# EasyEDA schematic LucidVRSensorPCB Side.json
TITLE: LucidVRSensorProto5; REV: 1.0; Date: 2022-12-27; Sheet: 1/1; Company: moonwiz
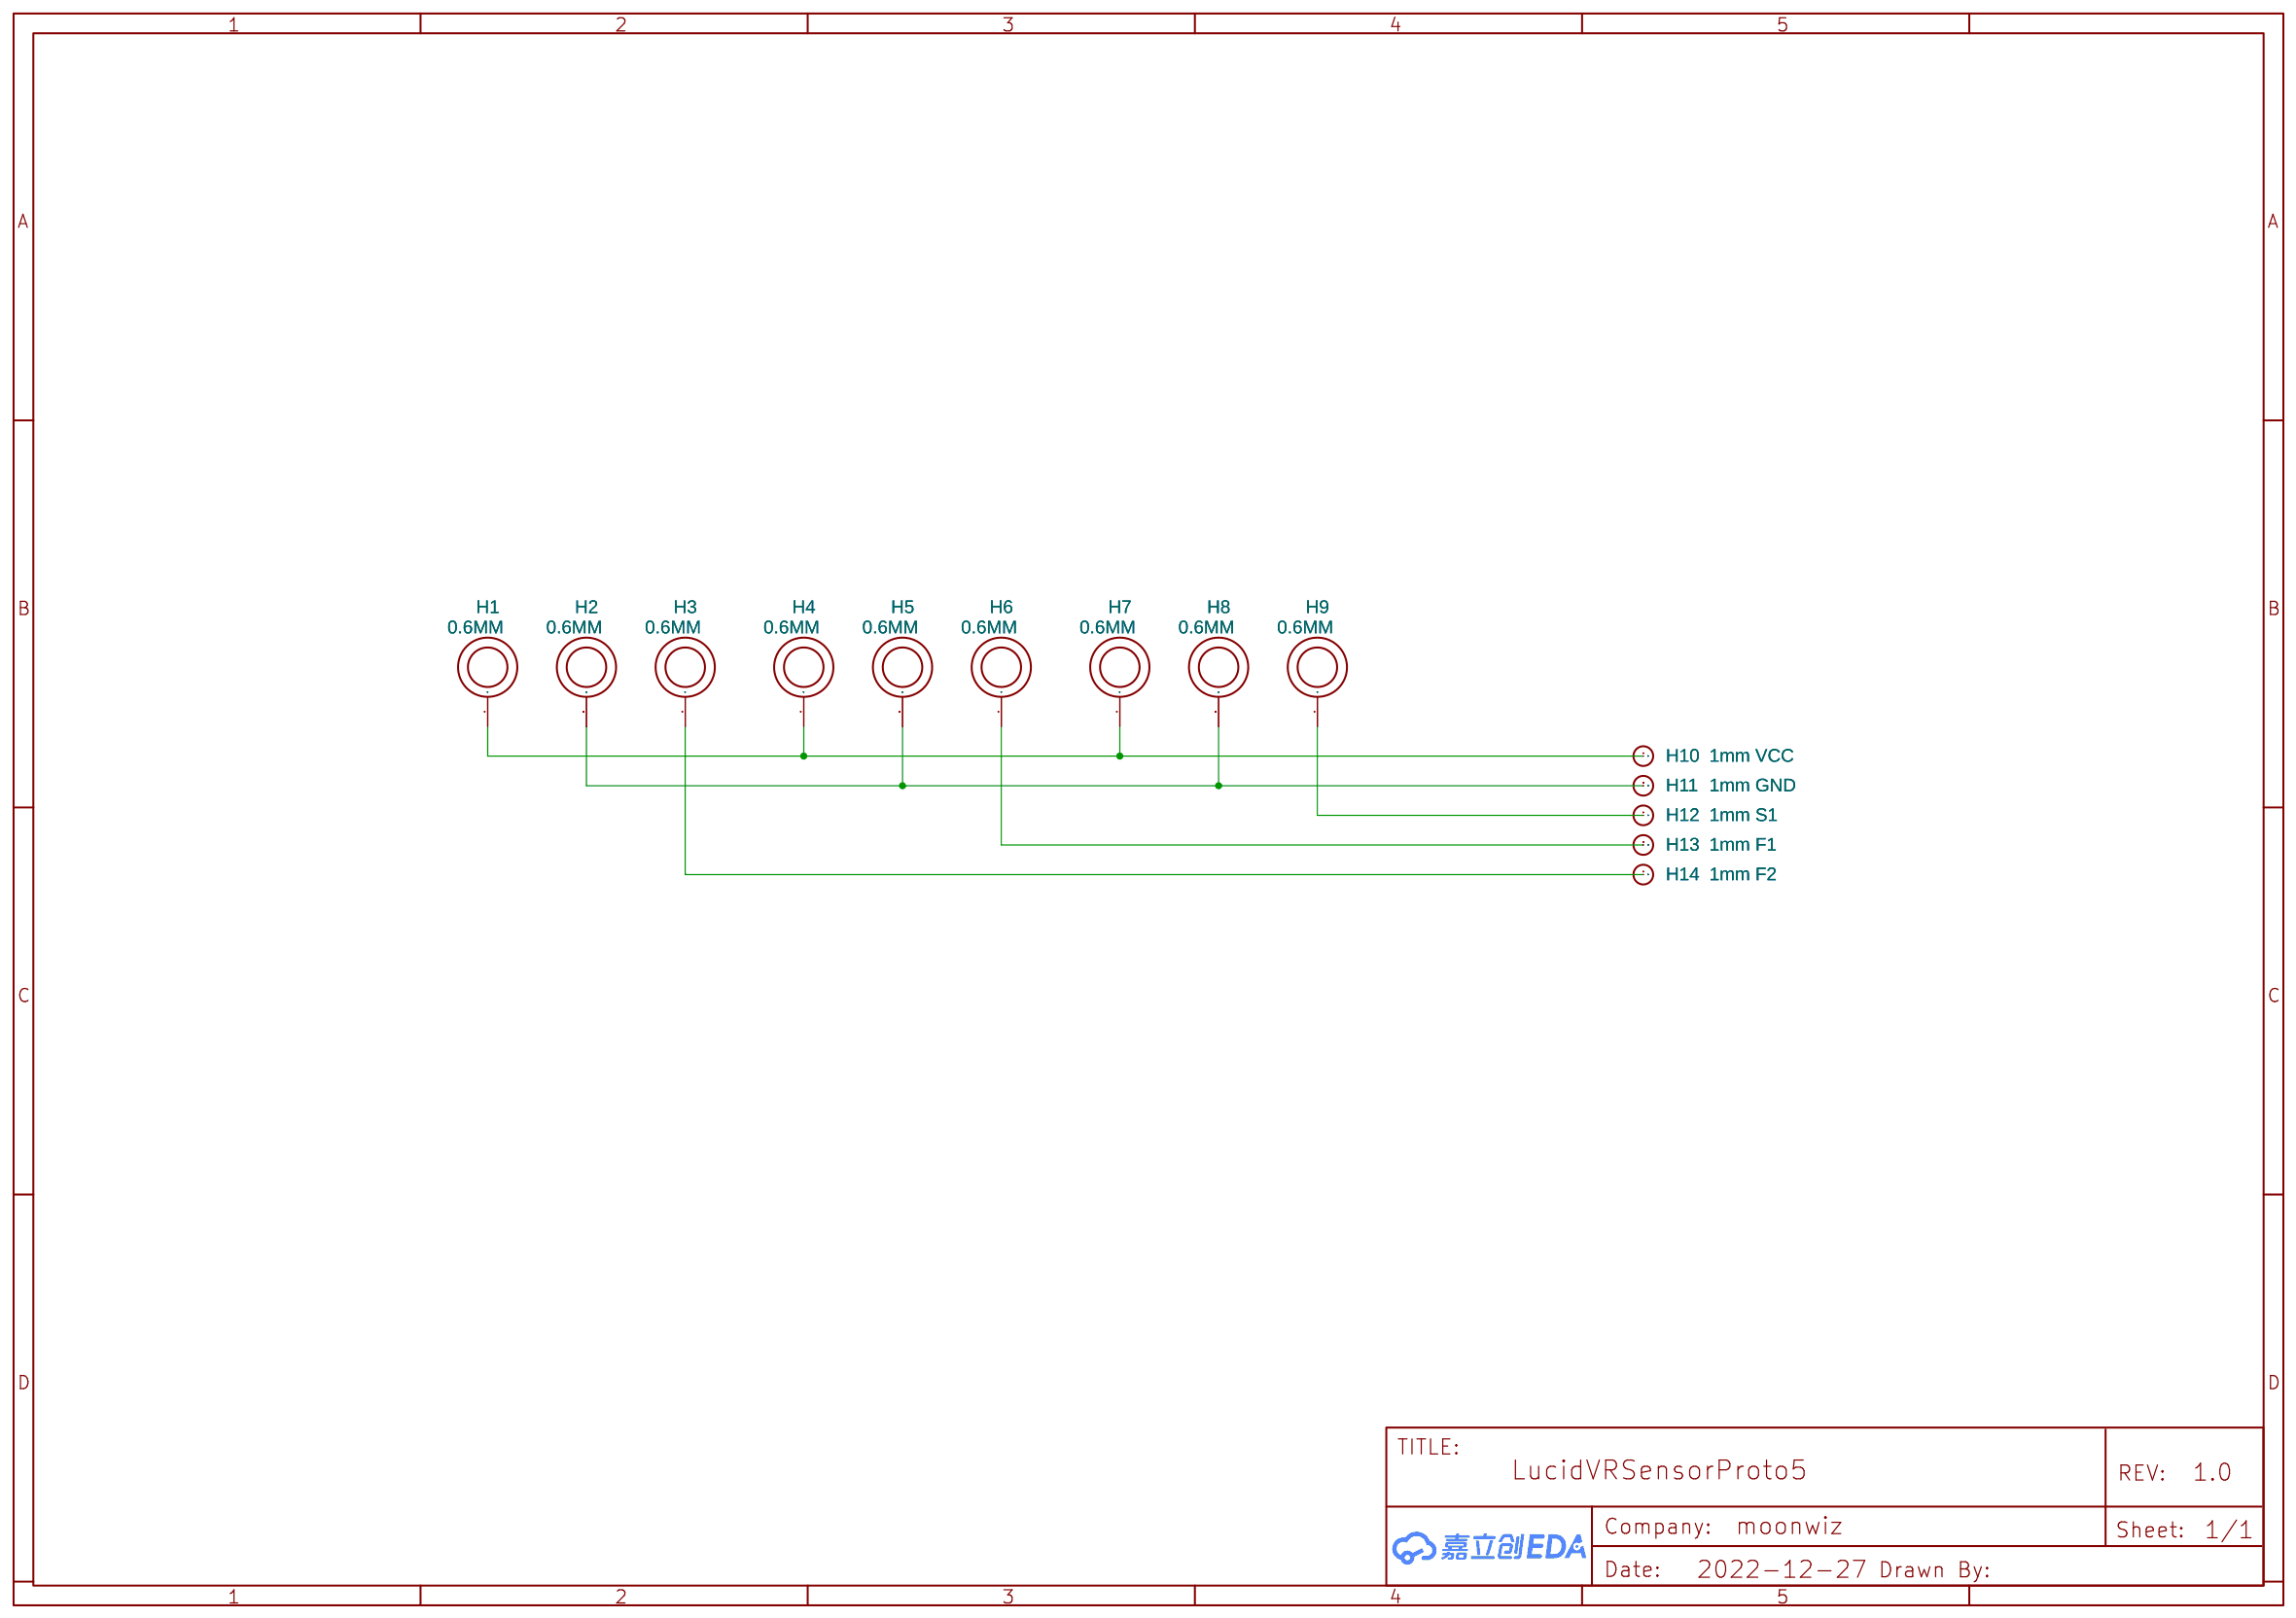
[diagram p0: schematic sheet]

## Parts
H1  0.6MM  [HOLEHOLE]
H2  0.6MM  [HOLEHOLE]
H3  0.6MM  [HOLEHOLE]
H4  0.6MM  [HOLEHOLE]
H5  0.6MM  [HOLEHOLE]
H6  0.6MM  [HOLEHOLE]
H7  0.6MM  [HOLEHOLE]
H8  0.6MM  [HOLEHOLE]
H9  0.6MM  [HOLEHOLE]
H10  1mm VCC  [THROUGH-HOLE-1MM]
H11  1mm GND  [THROUGH-HOLE-1MM]
H12  1mm S1  [THROUGH-HOLE-1MM]
H13  1mm F1  [THROUGH-HOLE-1MM]
H14  1mm F2  [THROUGH-HOLE-1MM]

## Library data of the parts
H1-H9 = HOLE 3.4: Contributor: Cillié Malan
H10-H14 = Through_Hole_1mm: Supplier Part: undefined; Contributor: P-Thomsen

## Nets
Net-(H1-1): H1.1 H4.1 H7.1 H10.1
Net-(H2-1): H2.1 H5.1 H8.1 H11.1
Net-(H3-1): H3.1 H14.1
Net-(H6-1): H6.1 H13.1
Net-(H9-1): H9.1 H12.1
